# Altium project analog_breakout_IMU.PrjPcb
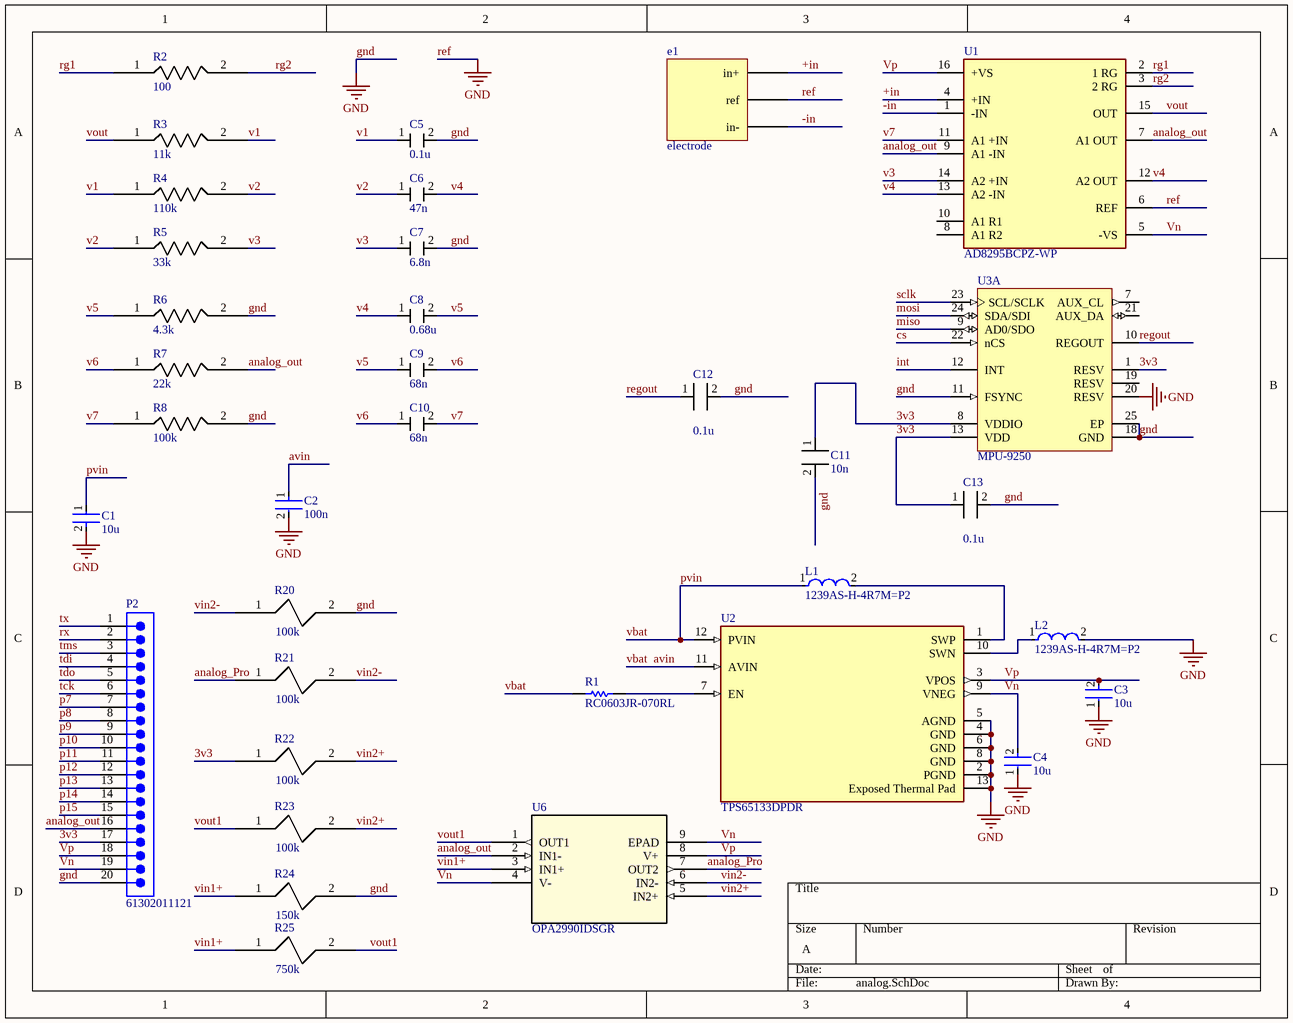
[diagram p0: analog.SchDoc]
3 sheets, 81 parts. Net scope: global (net labels, ports and power ports of the same name join across sheets).
Board file: analog_breakout_IMU.PcbDoc
Sheets:
  analog.SchDoc
  usb.SchDoc
  esp32.SchDoc

## Sheet analog.SchDoc
size A; SheetNumber: 1; SheetTotal: 2

### Parts
C1  10u  [FP-C1608-080-0_1-MFG]
C2  100n  [FP-CGA3E-0_3-0_1-IPC_A]
C3  10u  [FP-C1608-080-0_1-MFG]
C4  10u  [FP-C1608-080-0_1-MFG]
C5  C: 0.1u  [GeneralCap]  (hidden comment: genCap)
C6  C: 47n  [GeneralCap]  (hidden comment: genCap)
C7  C: 6.8n  [GeneralCap]  (hidden comment: genCap)
C8  C: 0.68u  [GeneralCap]  (hidden comment: genCap)
C9  C: 68n  [GeneralCap]  (hidden comment: genCap)
C10  C: 68n  [GeneralCap]  (hidden comment: genCap)
C11  C: 10n  [GeneralCap]  (hidden comment: genCap)
C12  C: 0.1u  [GeneralCap]  (hidden comment: genCap)
C13  C: 0.1u  [GeneralCap]  (hidden comment: genCap)
e1  electrode  [electrode]
L1  1239AS-H-4R7M=P2  [FP-DFE252012C-IPC_A]
L2  1239AS-H-4R7M=P2  [FP-DFE252012C-IPC_A]
P2  61302011121  [61302011121]
R1  RC0603JR-070RL  [RESC1608X55X25ML10T15]
R2  R: 100  [GeneralCap]  (hidden comment: genRes)
R3  R: 11k  [GeneralCap]  (hidden comment: genRes)
R4  R: 110k  [GeneralCap]  (hidden comment: genRes)
R5  R: 33k  [GeneralCap]  (hidden comment: genRes)
R6  R: 4.3k  [GeneralCap]  (hidden comment: genRes)
R7  R: 22k  [GeneralCap]  (hidden comment: genRes)
R8  R: 100k  [GeneralCap]  (hidden comment: genRes)
R20  R: 100k  [GeneralCap]  (hidden comment: genRes)
R21  R: 100k  [GeneralCap]  (hidden comment: genRes)
R22  R: 100k  [GeneralCap]  (hidden comment: genRes)
R23  R: 100k  [GeneralCap]  (hidden comment: genRes)
R24  R: 150k  [GeneralCap]  (hidden comment: genRes)
R25  R: 750k  [GeneralCap]  (hidden comment: genRes)
U1  AD8295BCPZ-WP  [FP-CP-16-19-IPC_C]
U2  TPS65133DPDR  [FP-DPD0012A-MFG]
U3  MPU-9250  [INSE-QFN-24-1700X1540TP_M]  (part A of 2)
U6  OPA2990IDSGR  [WSON8_DSG_TEX]

### Nets
gnd: C1.2 C2.2 C3.1 C4.1 C5.2 C7.2 C11.2 C12.2 C13.2 e1.ref L2.2 P2.20 R6.2 R8.2 R20.2 R24.2 U1.6(REF) U2.2(PGND) U2.4(GND) U2.5(AGND) U2.6(GND) U2.8(GND) U2.13(Exposed_Thermal_Pad) U3.11(FSYNC) U3.18(GND) U3.20(RESV) U3.25(EP)  [also labelled ref]
3v3: C11.1 C13.1 P2.17 R22.1 U3.1(RESV) U3.8(VDDIO) U3.13(VDD)
+in: e1.in+ U1.4(+IN)
-in: e1.in- U1.1(-IN)
analog_out: P2.16 R7.2 U1.7(A1_OUT) U1.9(A1_-IN) U6.2(IN1-)
analog_Pro: R21.1 U6.7(OUT2)
avin: C1.1 C2.1 L1.1 R1.1 U2.11(AVIN) U2.12(PVIN)  [also labelled pvin, vbat]
cs: U3.22(nCS)
int: U3.12(INT)
miso: U3.9(AD0/SDO)
mosi: U3.24(SDA/SDI)
p7: P2.7
p8: P2.8
p9: P2.9
p10: P2.10
p11: P2.11
p12: P2.12
p13: P2.13
p14: P2.14
p15: P2.15
regout: C12.1 U3.10(REGOUT)
rg1: R2.1 U1.2(1_RG)
rg2: R2.2 U1.3(2_RG)
rx: P2.2
sclk: U3.23(SCL/SCLK)
tck: P2.6
tdi: P2.4
tdo: P2.5
tms: P2.3
tx: P2.1
v1: C5.1 R3.2 R4.1
v2: C6.1 R4.2 R5.1
v3: C7.1 R5.2 U1.14(A2_+IN)
v4: C6.2 C8.1 U1.12(A2_OUT) U1.13(A2_-IN)
v5: C8.2 C9.1 R6.1
v6: C9.2 C10.1 R7.1
v7: C10.2 R8.1 U1.11(A1_+IN)
vin1+: R24.1 R25.1 U6.3(IN1+)
vin2+: R22.2 R23.2 U6.5(IN2+)
vin2-: R20.1 R21.2 U6.6(IN2-)
Vn: C4.2 P2.19 U1.5(-VS) U2.9(VNEG) U6.4(V-) U6.9(EPAD)
vout: R3.1 U1.15(OUT)
vout1: R23.1 R25.2 U6.1(OUT1)
Vp: C3.2 P2.18 U1.16(+VS) U2.3(VPOS) U6.8(V+)
NetL1_2: L1.2 U2.1(SWP)
NetL2_1: L2.1 U2.10(SWN)
NetR1_2: R1.2 U2.7(EN)

Not connected (* = marked no-connect by the designer): U1 8(A1_R2) 10(A1_R1); U3 7(AUX_CL) 19(RESV) 21(AUX_DA)

### Library data of the parts
C1 = CMP-2000-04979-3: C19702; Dielectric Material: Ceramic; Voltage Rating (DC): 10V; Tolerance: 10%; Dielectric: X5R; Capacitance: 10uF; Construction: Flat; Height: 0.8mm; Thickness: 0.035inch; Case Code (Metric): 1608; Radiation Hardening: No; Number of Pins: 2; Depth: 0.8mm; Voltage: 10V; RoHS Compliant: Yes; Voltage Rating: 10V; Package Quantity: 1; Resistor Type: Ceramic; Termination: SMD/SMT; Lead Free: Lead Free; REACH SVHC: No SVHC; Mount: Surface Mount; Series: C; Packaging: Tape and Reel; Width: 0.8mm; Weight: 7.1E-05oz; Length: 1.6mm; Max Operating Temperature: 85°C; Case Code (Imperial): 0603; Case/Package: 0603; Min Operating Temperature: -55°C
C2 = CMP-2000-07546-2: C14663; Dielectric: X7R; Tolerance: 10%; Voltage Rating: 50V; Capacitance: 100nF; Weight: 7.1E-05oz; Composition: Ceramic; Max Operating Temperature: 125°C; Termination: SMD/SMT; Length: 1.6mm; Package Quantity: 1; REACH SVHC: No SVHC; Lead Free: Lead Free; Case Code (Metric): 1608; Min Operating Temperature: -55°C; Packaging: Tape and Reel; Case Code (Imperial): 0603; Case/Package: 0603; Voltage Rating (DC): 50V; Depth: 0.8mm; Radiation Hardening: No; Ratings: AEC-Q200; Mount: Surface Mount; Voltage: 50V; Thickness: 0.035inch; Width: 0.8mm; Height: 0.8mm
C3 C4 = CMP-2000-04979-3: C6119842; Dielectric Material: Ceramic; Voltage Rating (DC): 10V; Tolerance: 10%; Dielectric: X5R; Capacitance: 10uF; Construction: Flat; Height: 0.8mm; Thickness: 0.035inch; Case Code (Metric): 1608; Radiation Hardening: No; Number of Pins: 2; Depth: 0.8mm; Voltage: 10V; RoHS Compliant: Yes; Voltage Rating: 10V; Package Quantity: 1; Resistor Type: Ceramic; Termination: SMD/SMT; Lead Free: Lead Free; REACH SVHC: No SVHC; Mount: Surface Mount; Series: C; Packaging: Tape and Reel; Width: 0.8mm; Weight: 7.1E-05oz; Length: 1.6mm; Max Operating Temperature: 85°C; Case Code (Imperial): 0603; Case/Package: 0603; Min Operating Temperature: -55°C
C5 C12 C13 = genCap: C14663
C6 = genCap: C107093
C7 = genCap: C162241
C8 = genCap: C694504
C9 C10 = genCap: C107098
C11 = genCap: C100042
L1 L2 = CMP-06042-003985-1: C882976; Inductance: 4.7uH; Current Rating: 1.5A; Tolerance: 20%; Shielding: Shielded; Core Material: Ferrite; DC Resistance (DCR): 240mR; Test Frequency: 1MHz; Resistor Type: Wirewound; Mount: Surface Mount; Case/Package: 1008; Case Code (Metric): 2520; Width: 0.079inch; Min Operating Temperature: -40°C; Height - Seated (Max): 0.047inch; Length: 0.098inch; Max Operating Temperature: 85°C; Case Code (Imperial): 1008; Packaging: Tape and Reel
P2 = CMP-1502-01102-3: NexarPartId: 32855554; Operating Supply Voltage: 250V; Gender: Male; Current Rating: 3A; Contact Resistance: 20mΩ; Number of Contacts: 20; Pitch: 2.54mm; Connector Type: Male Pin; RoHS: Compliant; Contact Plating: Gold; REACH SVHC: Unknown; Packaging: Bulk; Lead Pitch: 2.54mm; Mount: Through Hole; Termination: Solder; Number of Pins: 20; Contact Mating Length: 5.9944mm; Number of Rows: 1; Color: Black; Contact Material: Copper; Orientation: Vertical; Number of Positions: 20
R1 = CMP-2100-03667-1: C95177; Manufacturer: Yageo; Temperature Coefficient: 200ppm/degreesC; Tolerance: 5%; Voltage Rating: 50V; Power Rating: 100mW; Resistance: 0mOhm; Width: 0.8mm; Max Operating Temperature: 155degC; Package Reference: 0603; Height: 0.45mm; Depth: 0.8mm; Package Description: 2-Pin Surface Mount Device, Body 1.6 x 0.8 mm; Termination: SMD/SMT; Package Quantity: 5000; Case/Package: 0603; Case Code (Imperial): 0603; Radiation Hardening: No; Number of Pins: 2; Length: 1.6mm; Lead Free: LeadFree; Voltage Rating (DC): 50V; Military Standard: Not; Datasheet URL: http://www.yageo.com/NewPortal/yageodocoutput?fileName=/pdf/R-Chip/PYu-RC_Group_51_RoHS_L_5.pdf; Manufacturer URL: http://www.yageo.com/; Packaging: TapeandReel; Case Code (Metric): 1608; Min Operating Temperature: -55degC; Composition: ThickFilm; RoHSCompliant: true; Contact Plating: Tin; Datasheet Version: Rev. 5, 10/2016; REACH SVHC: NoSVHC
R2 = genRes: C105588
R3 = genRes: C137801
R4 = genRes: C2906984
R5 = genRes: C4216
R6 = genRes: C2088918
R7 = genRes: C2907015
R8 R20-R23 = genRes: C14675
R24 = genRes: C2906993
R25 = genRes: C2849084
U1 = CMP-09116-000488-1: IC INST AMP 3 CIRCUIT 16LFCSP; Min Supply Voltage: 2.3V; Number of Circuits: 3; Nominal Supply Current: 2mA; Operating Supply Current: 2.3mA; Dual Supply Voltage: 9V; Max Dual Supply Voltage: 18V; Input Offset Voltage (Vos): 120uV; Common Mode Rejection Ratio: 140dB; Amplifier Type: INSTRUMENTATION AMPLIFIER; Output Current per Channel: 18mA; Input Bias Current: 800pA; Input Resistance: 100GR; Number of Amplifiers: 2; Slew Rate: 2V/µs; Gain Bandwidth Product: 1MHz; -3db Bandwidth: 1.2MHz; Voltage Gain: 60dB; Power Supply Rejection Ratio (PSRR): 150dB; Number of Elements: 1; Width: 4mm; Max Operating Temperature: 85°C; Supply Current: 2mA; Series: -; Height: 0.83mm; Case/Package: VQFN; Packaging: Waffle; Min Dual Supply Voltage: 2.3V; Mount: Surface Mount; Max Supply Voltage: 18V; Contact Plating: Tin; Min Operating Temperature: -40°C; Reach SVHC Compliant: Yes; Package Quantity: 64; Number of Channels: 3; Number of Pins: 16; Length: 4mm; Bandwidth: 1.2MHz; RoHS Compliant: Yes; Lead Free: Contains Lead
U2 = CMP-04918-000430-1: C134100; Number of Channels: 2; Max Supply Voltage: 5V; Min Supply Voltage: 2.9V; Output Voltage: -5V; Mount: Surface Mount; Case/Package: QFN; Packaging: Tape and Reel; Lead Free: Lead Free; Radiation Hardening: No; Min Operating Temperature: -40°C; Number of Outputs: 2; Max Operating Temperature: 85°C; Number of Pins: 12; RoHS Compliant: Yes; Package Quantity: 3000
U3 = CMP-2100-03657-1: 9-axis MotionTracking device, 2.4 to 3,6 V, -40 to 85 degC, 24-Pin QFN, RoHS, Tape and Reel; Manufacturer: InvenSense; Max Supply Voltage: 3.6V; Min Supply Voltage: 2.4V; Package Reference: QFN-24; Package Quantity: 1; Datasheet Version: Rev. 1.0, 01/2014; Case/Package: QFN; Package Description: 24-Pin Quad Flat No-lead Package, Body 3 x 3 mm, Pitch 0.4 mm; Datasheet URL: http://datasheet.octopart.com/MPU-9250-InvenSense-datasheet-21859386.pdf; RoHSCompliant: true; Max Operating Temperature: 85degC; Height: 1mm; Mount: SurfaceMount; Manufacturer URL: http://www.invensense.com/; Width: 3.1mm; Min Operating Temperature: -40degC; Length: 3.1mm
U6 = OPA2990IDSGR: C2057874; Mfr_Name: Texas Instruments; RefDes: RefDes; Type: Type

## Sheet usb.SchDoc
size A; SheetNumber: 2; SheetTotal: 3
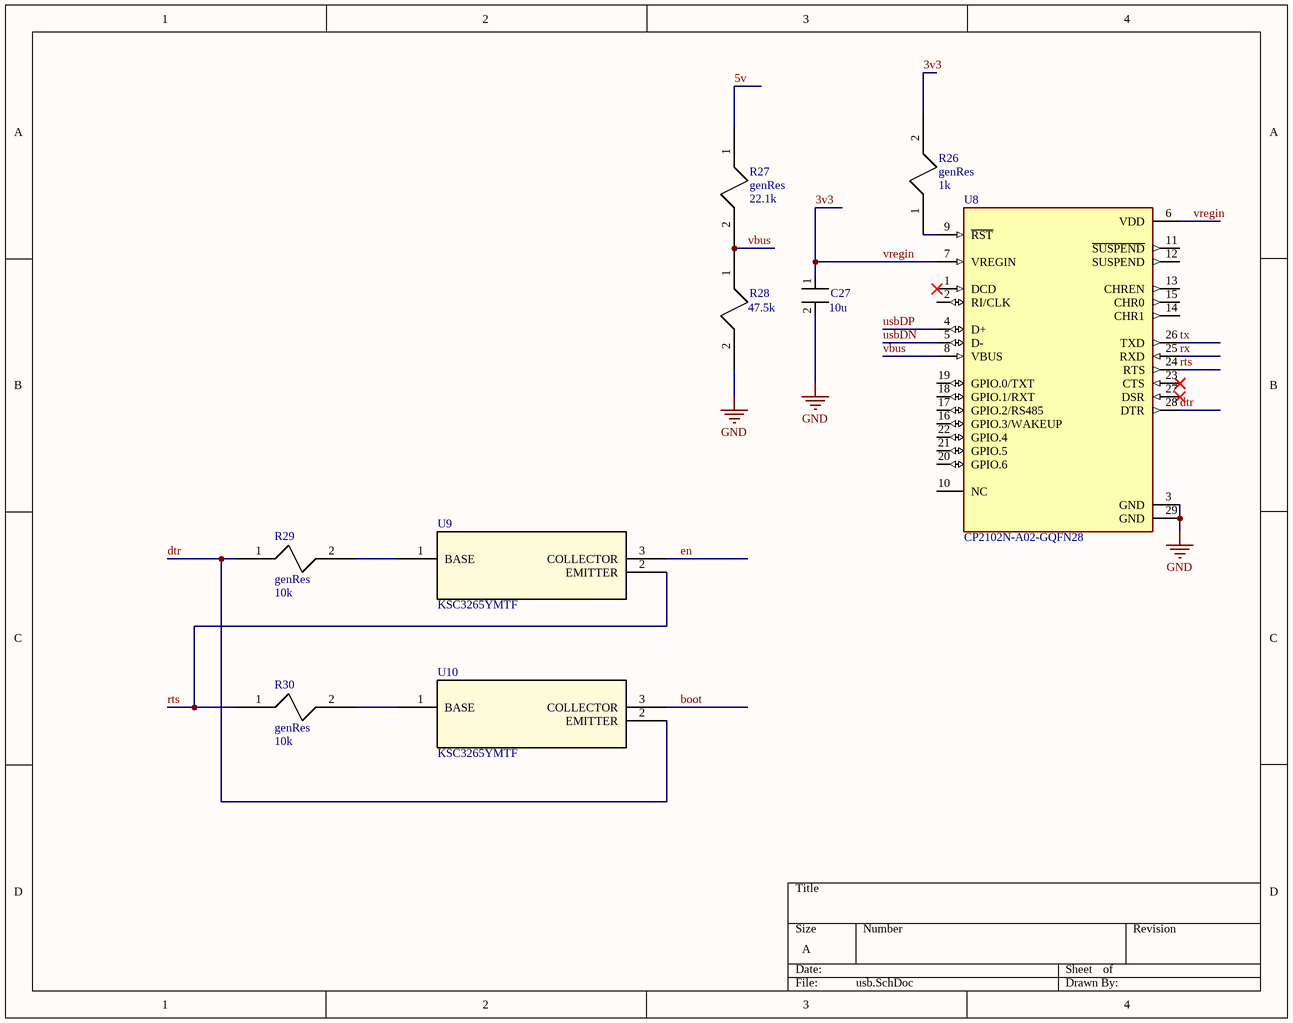
[diagram p1: usb.SchDoc]

### Parts
C27  C: 10u  [GeneralCap]  (hidden comment: genCap)
R26  genRes  R: 1k  [GeneralCap]
R27  genRes  R: 22.1k  [GeneralCap]
R28  R: 47.5k  [GeneralCap]  (hidden comment: genRes)
R29  genRes  R: 10k  [GeneralCap]
R30  genRes  R: 10k  [GeneralCap]
U8  CP2102N-A02-GQFN28  [QFN50P500X500X80-29N]
U9  KSC3265YMTF  [SOT-23_ONS]
U10  KSC3265YMTF  [SOT-23_ONS]

### Nets
gnd: C27.2 R28.2 U8.3(GND) U8.29(GND)
3v3: C27.1 R26.2 U8.6(VDD) U8.7(VREGIN)  [also labelled vregin]
5v: R27.1
boot: U10.3(COLLECTOR)
dtr: R29.1 U8.28(DTR) U10.2(EMITTER)
en: U9.3(COLLECTOR)
rts: R30.1 U8.24(RTS) U9.2(EMITTER)
rx: U8.25(RXD)
tx: U8.26(TXD)
usbDN: U8.5(D-)
usbDP: U8.4(D+)
vbus: R27.2 R28.1 U8.8(VBUS)
NetR26_1: R26.1 U8.9(~{RST})
NetR29_2: R29.2 U9.1(BASE)
NetR30_2: R30.2 U10.1(BASE)

Not connected (* = marked no-connect by the designer): U8 1(DCD)* 2(RI/CLK) 10(NC) 11(~{SUSPEND}) 12(SUSPEND) 13(CHREN) 14(CHR1) 15(CHR0) 16(GPIO.3/WAKEUP) 17(GPIO.2/RS485) 18(GPIO.1/RXT) 19(GPIO.0/TXT) 20(GPIO.6) 21(GPIO.5) 22(GPIO.4) 23(CTS)* 27(DSR)*

### Library data of the parts
C27 = genCap: C6119842
R26 = genRes: C22548
R27 = genRes: C137768
R28 = genRes: C705990
R29 R30 = genRes: C98220
U8 = CP2102N-A02-GQFN28: C1550553; MF: Silicon Labs; Value: *; Price: None; Package: WFQFN-28 Silicon Labs; Check_prices: https://www.snapeda.com/parts/CP2102N-A02-GQFN28/Silicon+Labs/view-part/?ref=eda; Availability: In Stock; SnapEDA_Link: https://www.snapeda.com/parts/CP2102N-A02-GQFN28/Silicon+Labs/view-part/?ref=snap; Purchase-URL: https://pricing.snapeda.com/search/part/CP2102N-A02-GQFN28/?ref=eda; MP: CP2102N-A02-GQFN28
U9 U10 = KSC3265YMTF: C14809; Mfr_Name: onsemi; RefDes: RefDes; Type: Type

## Sheet esp32.SchDoc
size A; SheetNumber: 3; SheetTotal: 2
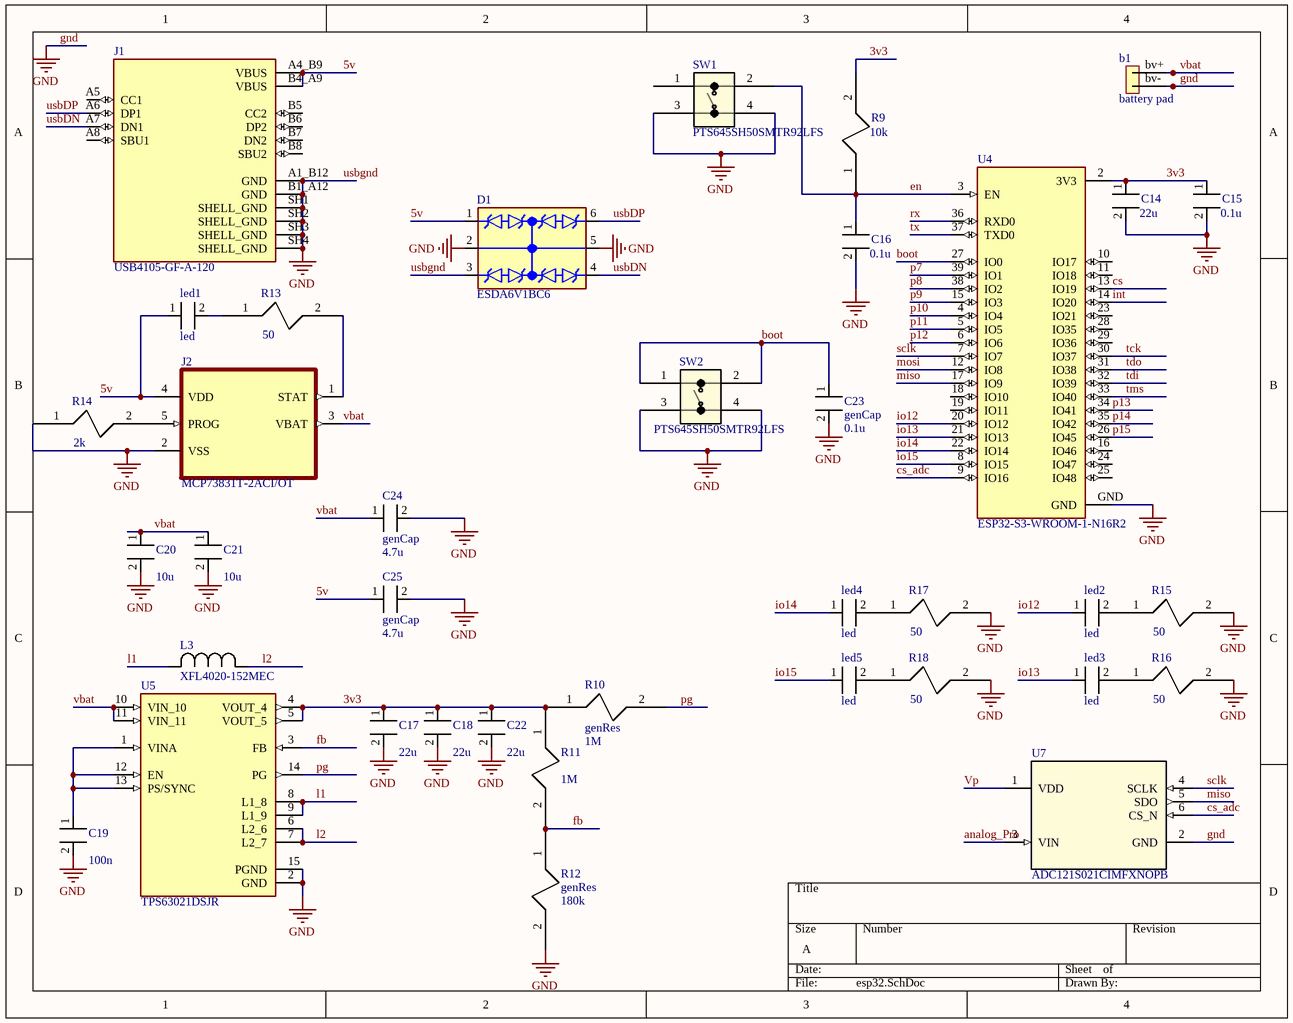
[diagram p2: esp32.SchDoc]

### Parts
b1  battery pad  [bat_pads]
C14  C: 22u  [GeneralCap]  (hidden comment: genCap)
C15  C: 0.1u  [GeneralCap]  (hidden comment: genCap)
C16  C: 0.1u  [GeneralCap]  (hidden comment: genCap)
C17  C: 22u  [GeneralCap]  (hidden comment: genCap)
C18  C: 22u  [GeneralCap]  (hidden comment: genCap)
C19  C: 100n  [GeneralCap]  (hidden comment: genCap)
C20  C: 10u  [GeneralCap]  (hidden comment: genCap)
C21  C: 10u  [GeneralCap]  (hidden comment: genCap)
C22  C: 22u  [GeneralCap]  (hidden comment: genCap)
C23  genCap  C: 0.1u  [GeneralCap]
C24  genCap  C: 4.7u  [GeneralCap]
C25  genCap  C: 4.7u  [GeneralCap]
D1  ESDA6V1BC6  [SOT95P280X145-6N]
J1  USB4105-GF-A-120  [GCT_USB4105-GF-A-120]
J2  MCP73831T-2ACI/OT  [SOT95P280X145-5N]
L3  XFL4020-152MEC  [IND_XFL4020_COC]
led1  led  [GeneralCap]
led2  led  [GeneralCap]
led3  led  [GeneralCap]
led4  led  [GeneralCap]
led5  led  [GeneralCap]
R9  R: 10k  [GeneralCap]  (hidden comment: genRes)
R10  genRes  R: 1M  [GeneralCap]
R11  R: 1M  [GeneralCap]  (hidden comment: genRes)
R12  genRes  R: 180k  [GeneralCap]
R13  R: 50  [GeneralCap]  (hidden comment: genRes)
R14  R: 2k  [GeneralCap]  (hidden comment: genRes)
R15  R: 50  [GeneralCap]  (hidden comment: genRes)
R16  R: 50  [GeneralCap]  (hidden comment: genRes)
R17  R: 50  [GeneralCap]  (hidden comment: genRes)
R18  R: 50  [GeneralCap]  (hidden comment: genRes)
SW1  PTS645SH50SMTR92LFS  [PTS645S_SMTR92_CNK]
SW2  PTS645SH50SMTR92LFS  [PTS645S_SMTR92_CNK]
U4  ESP32-S3-WROOM-1-N16R2  [XCVR_ESP32-S3-WROOM-1-N16R2]
U5  TPS63021DSJR  [IC_TPS63021DSJR]
U7  ADC121S021CIMFXNOPB  [DBV0006A_N]

### Nets
gnd: b1.bv- C14.2 C15.2 C16.2 C17.2 C18.2 C19.2 C20.2 C21.2 C22.2 C23.2 C24.2 C25.2 D1.2(CC1) D1.3(C2) D1.5(CC2) J1.A1_B12(GND) J1.B1_A12(GND) J1.SH1(SHELL_GND) J1.SH2(SHELL_GND) J1.SH3(SHELL_GND) J1.SH4(SHELL_GND) J2.2(VSS) R12.2 R14.1 R15.2 R16.2 R17.2 R18.2 SW1.3 SW1.4 SW2.3 SW2.4 U4.GND U5.2(GND) U5.15(PGND) U7.2(GND)  [also labelled usbgnd]
3v3: C14.1 C15.1 C17.1 C18.1 C22.1 R9.2 R10.1 R11.1 U4.2(3V3) U5.4(VOUT_4) U5.5(VOUT_5)
5v: C25.1 D1.1(C1) J1.A4_B9(VBUS) J1.B4_A9(VBUS) J2.4(VDD) led1.1
analog_Pro: U7.3(VIN)
boot: C23.1 SW2.1 SW2.2 U4.27(IO0)
cs: U4.13(IO19)
cs_adc: U4.9(IO16) U7.6(CS_N)
en: C16.1 R9.1 SW1.2 U4.3(EN)
fb: R11.2 R12.1 U5.3(FB)
int: U4.14(IO20)
io12: led2.1 U4.20(IO12)
io13: led3.1 U4.21(IO13)
io14: led4.1 U4.22(IO14)
io15: led5.1 U4.8(IO15)
l1: L3.2 U5.8(L1_8) U5.9(L1_9)
l2: L3.1 U5.6(L2_6) U5.7(L2_7)
miso: U4.17(IO9) U7.5(SDO)
mosi: U4.12(IO8)
p7: U4.39(IO1)
p8: U4.38(IO2)
p9: U4.15(IO3)
p10: U4.4(IO4)
p11: U4.5(IO5)
p12: U4.6(IO6)
p13: U4.34(IO41)
p14: U4.35(IO42)
p15: U4.26(IO45)
pg: R10.2 U5.14(PG)
rx: U4.36(RXD0)
sclk: U4.7(IO7) U7.4(SCLK)
tck: U4.30(IO37)
tdi: U4.32(IO39)
tdo: U4.31(IO38)
tms: U4.33(IO40)
tx: U4.37(TXD0)
usbDN: D1.4(C3) J1.A7(DN1)
usbDP: D1.6(C4) J1.A6(DP1)
vbat: b1.bv+ C20.1 C21.1 C24.1 J2.3(VBAT) U5.10(VIN_10) U5.11(VIN_11)  [project net avin]
Vp: U7.1(VDD)
NetC19_1: C19.1 U5.1(VINA) U5.12(EN) U5.13(PS/SYNC)
NetJ2_1: J2.1(STAT) R13.2
NetJ2_5: J2.5(PROG) R14.2
Netled1_2: led1.2 R13.1
Netled2_2: led2.2 R15.1
Netled3_2: led3.2 R16.1
Netled4_2: led4.2 R17.1
Netled5_2: led5.2 R18.1

Not connected (* = marked no-connect by the designer): J1 A5(CC1) A8(SBU1) B5(CC2) B6(DP2) B7(DN2) B8(SBU2); SW1 1; U4 10(IO17) 11(IO18) 16(IO46) 18(IO10) 19(IO11) 23(IO21) 24(IO47) 25(IO48) 28(IO35) 29(IO36)

### Library data of the parts
C14 C17 C18 C22 = genCap: C86295
C15 C16 C19 C23 = genCap: C14663
C20 C21 = genCap: C6119842
C24 C25 = genCap: C19666
D1 = ESDA6V1BC6: C495220; MF: STMicroelectronics; Check_prices: https://www.snapeda.com/parts/ESDA6V1BC6/STMicroelectronics/view-part/?ref=eda; Price: None; MP: ESDA6V1BC6; Purchase-URL: https://pricing.snapeda.com/search/part/ESDA6V1BC6/?ref=eda; SnapEDA_Link: https://www.snapeda.com/parts/ESDA6V1BC6/STMicroelectronics/view-part/?ref=snap; Availability: In Stock; Package: SOT-23-6 STMicroelectronics; Value: *
J1 = USB4105-GF-A-120: MF: Global Connector Technology; MP: USB4105GFA120; SnapEDA_Link: https://www.snapeda.com/parts/USB4105GFA120/Global+Connector+Technology/view-part/?ref=snap; Package: None; Value: *; Check_prices: https://www.snapeda.com/parts/USB4105GFA120/Global+Connector+Technology/view-part/?ref=eda
J2 = MCP73831T-2ACI/OT: C424093; MF: Microchip; Package: SOT-23 Microchip; Purchase-URL: https://pricing.snapeda.com/search/part/MCP73831T-2ACI/OT/?ref=eda; MP: MCP73831T-2ACI/OT; Value: *; Availability: In Stock; SnapEDA_Link: https://www.snapeda.com/parts/MCP73831T-2ACI/OT/Microchip/view-part/?ref=snap; Price: None; Check_prices: https://www.snapeda.com/parts/MCP73831T-2ACI/OT/Microchip/view-part/?ref=eda
L3 = XFL4020-152MEC: C3033018; Mfr_Name: Coilcraft; Type: Fixed Inductors
led1-led5 = genCap: C965799; C: ?
R9 = genRes: C98220
R10 R11 = genRes: C105578
R12 = genRes: C123419
R13 R15-R18 = genRes: C844932
R14 = genRes: C22975
SW1 SW2 = PTS645SH50SMTR92LFS: C221869; Mfr_Name: C&K Components; Type: Tactile Switches; RefDes: RefDes
U4 = ESP32-S3-WROOM-1-N16R2: C2913205; MF: Espressif Systems; MP: ESP32S3WROOM1N16R2; SnapEDA_Link: https://www.snapeda.com/parts/ESP32S3WROOM1N16R2/Espressif+Systems/view-part/?ref=snap; Package: NON STANDARD Espressif Systems; Value: *; Check_prices: https://www.snapeda.com/parts/ESP32S3WROOM1N16R2/Espressif+Systems/view-part/?ref=eda
U7 = ADC121S021CIMFXNOPB: C701596; Mfr_Name: Texas Instruments; TYPE: TYPE; RefDes: RefDes
U5 = TPS63021DSJR: Price: None; MP: TPS63021DSJR; Value: *; Availability: Unavailable; Package: None

## Nets that join several sheets
gnd: analog (27 pins), usb (C27.2 R28.2 U8.3 U8.29), esp32 (37 pins)
3v3: analog (7 pins), usb (C27.1 R26.2 U8.6 U8.7), esp32 (11 pins)
5v: usb (R27.1), esp32 (6 pins)
analog_Pro: analog (R21.1 U6.7), esp32 (U7.3)
avin: analog (6 pins), esp32 (7 pins)
boot: usb (U10.3), esp32 (C23.1 SW2.1 SW2.2 U4.27)
cs: analog (U3.22), esp32 (U4.13)
en: usb (U9.3), esp32 (C16.1 R9.1 SW1.2 U4.3)
int: analog (U3.12), esp32 (U4.14)
miso: analog (U3.9), esp32 (U4.17 U7.5)
mosi: analog (U3.24), esp32 (U4.12)
p7: analog (P2.7), esp32 (U4.39)
p8: analog (P2.8), esp32 (U4.38)
p9: analog (P2.9), esp32 (U4.15)
p10: analog (P2.10), esp32 (U4.4)
p11: analog (P2.11), esp32 (U4.5)
p12: analog (P2.12), esp32 (U4.6)
p13: analog (P2.13), esp32 (U4.34)
p14: analog (P2.14), esp32 (U4.35)
p15: analog (P2.15), esp32 (U4.26)
rx: analog (P2.2), usb (U8.25), esp32 (U4.36)
sclk: analog (U3.23), esp32 (U4.7 U7.4)
tck: analog (P2.6), esp32 (U4.30)
tdi: analog (P2.4), esp32 (U4.32)
tdo: analog (P2.5), esp32 (U4.31)
tms: analog (P2.3), esp32 (U4.33)
tx: analog (P2.1), usb (U8.26), esp32 (U4.37)
usbDN: usb (U8.5), esp32 (D1.4 J1.A7)
usbDP: usb (U8.4), esp32 (D1.6 J1.A6)
Vp: analog (5 pins), esp32 (U7.1)